# EAGLE schematic typewriter_shift (EAGLE 7.2.0)
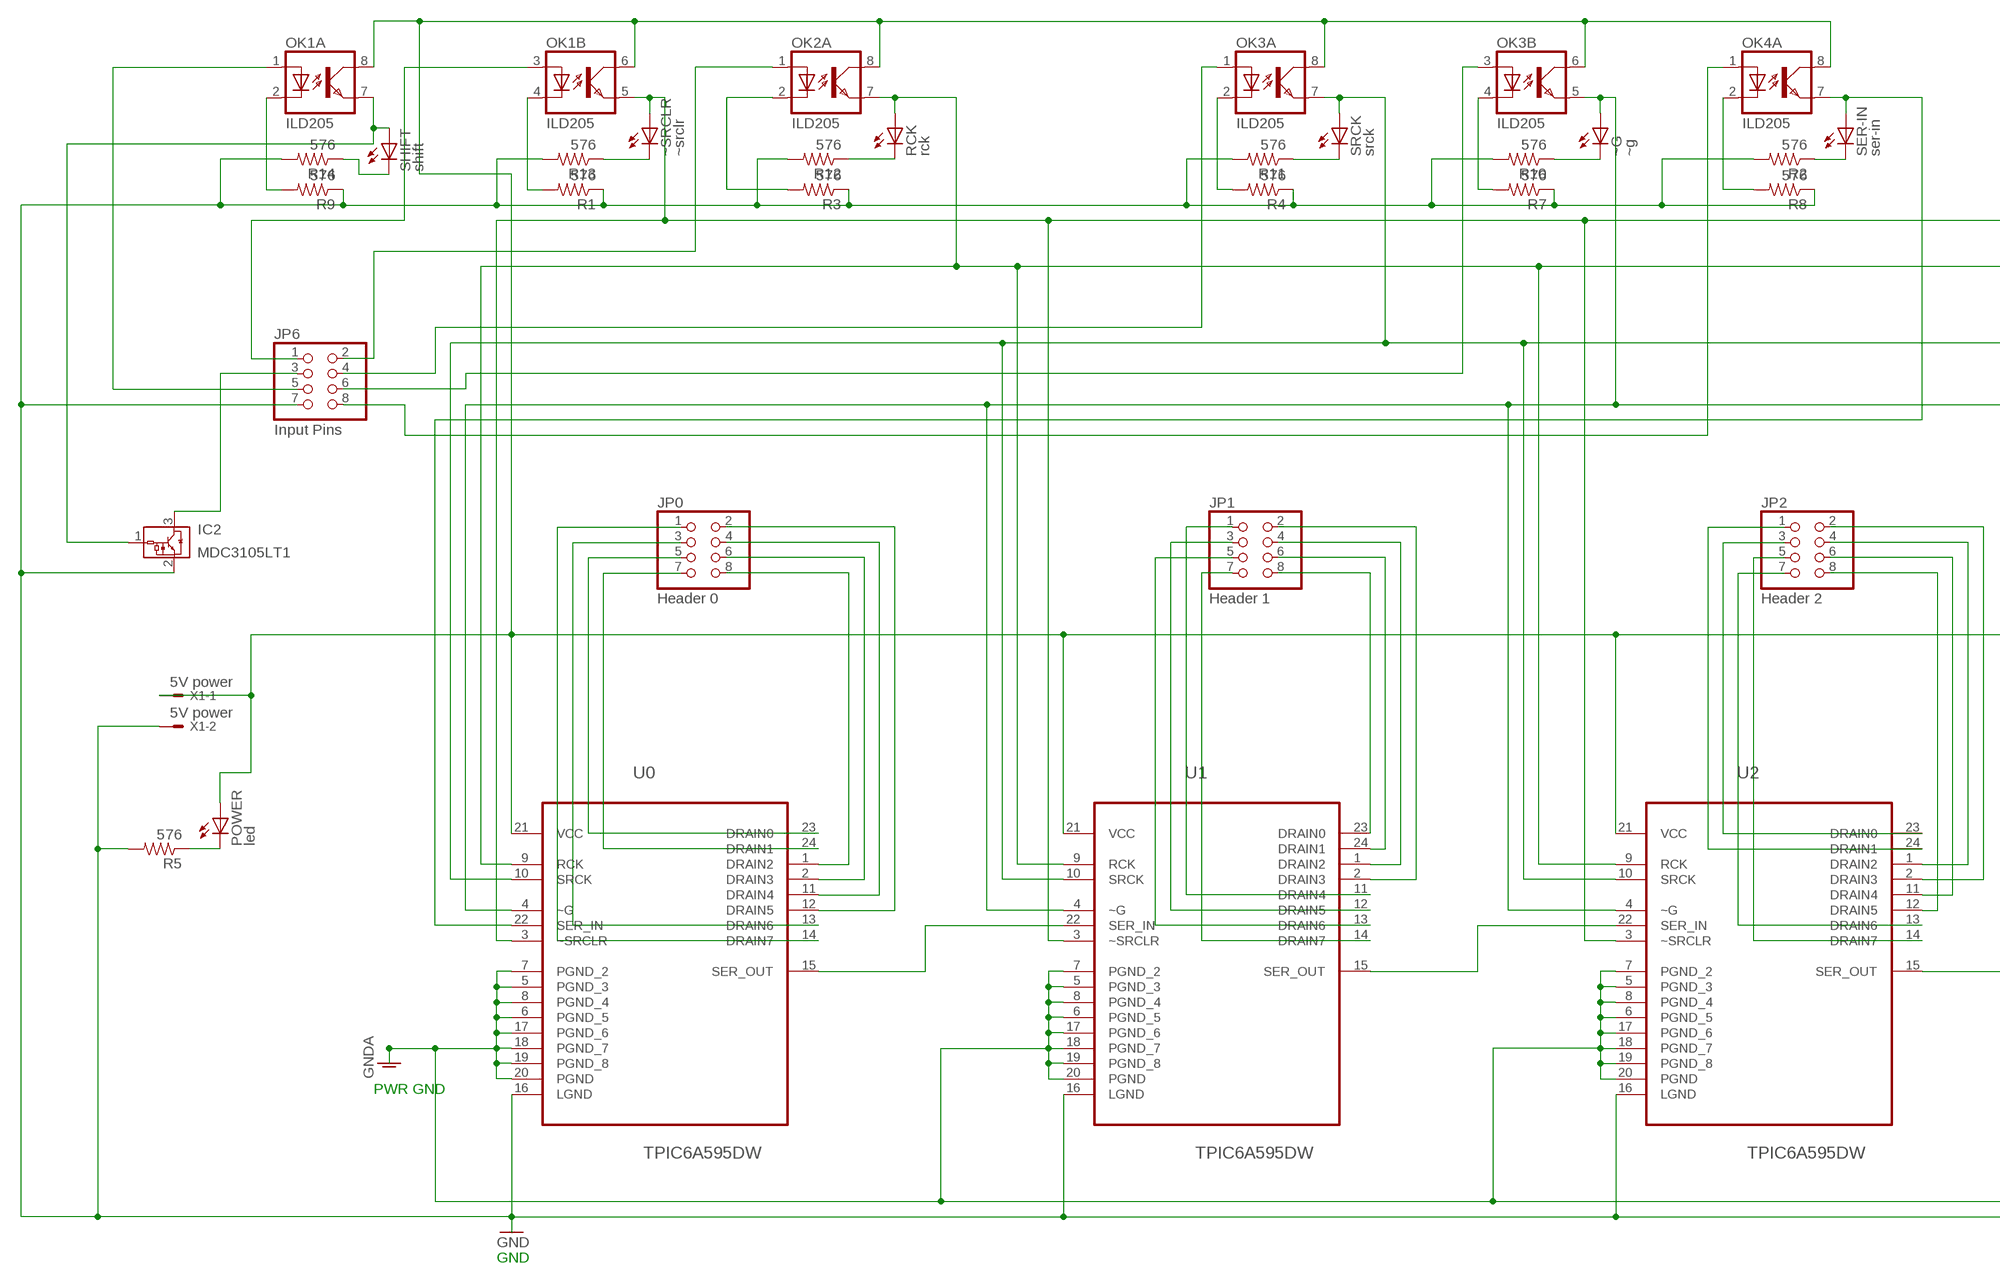
[diagram p0: schematic, sheet 1, part 1 of 2]
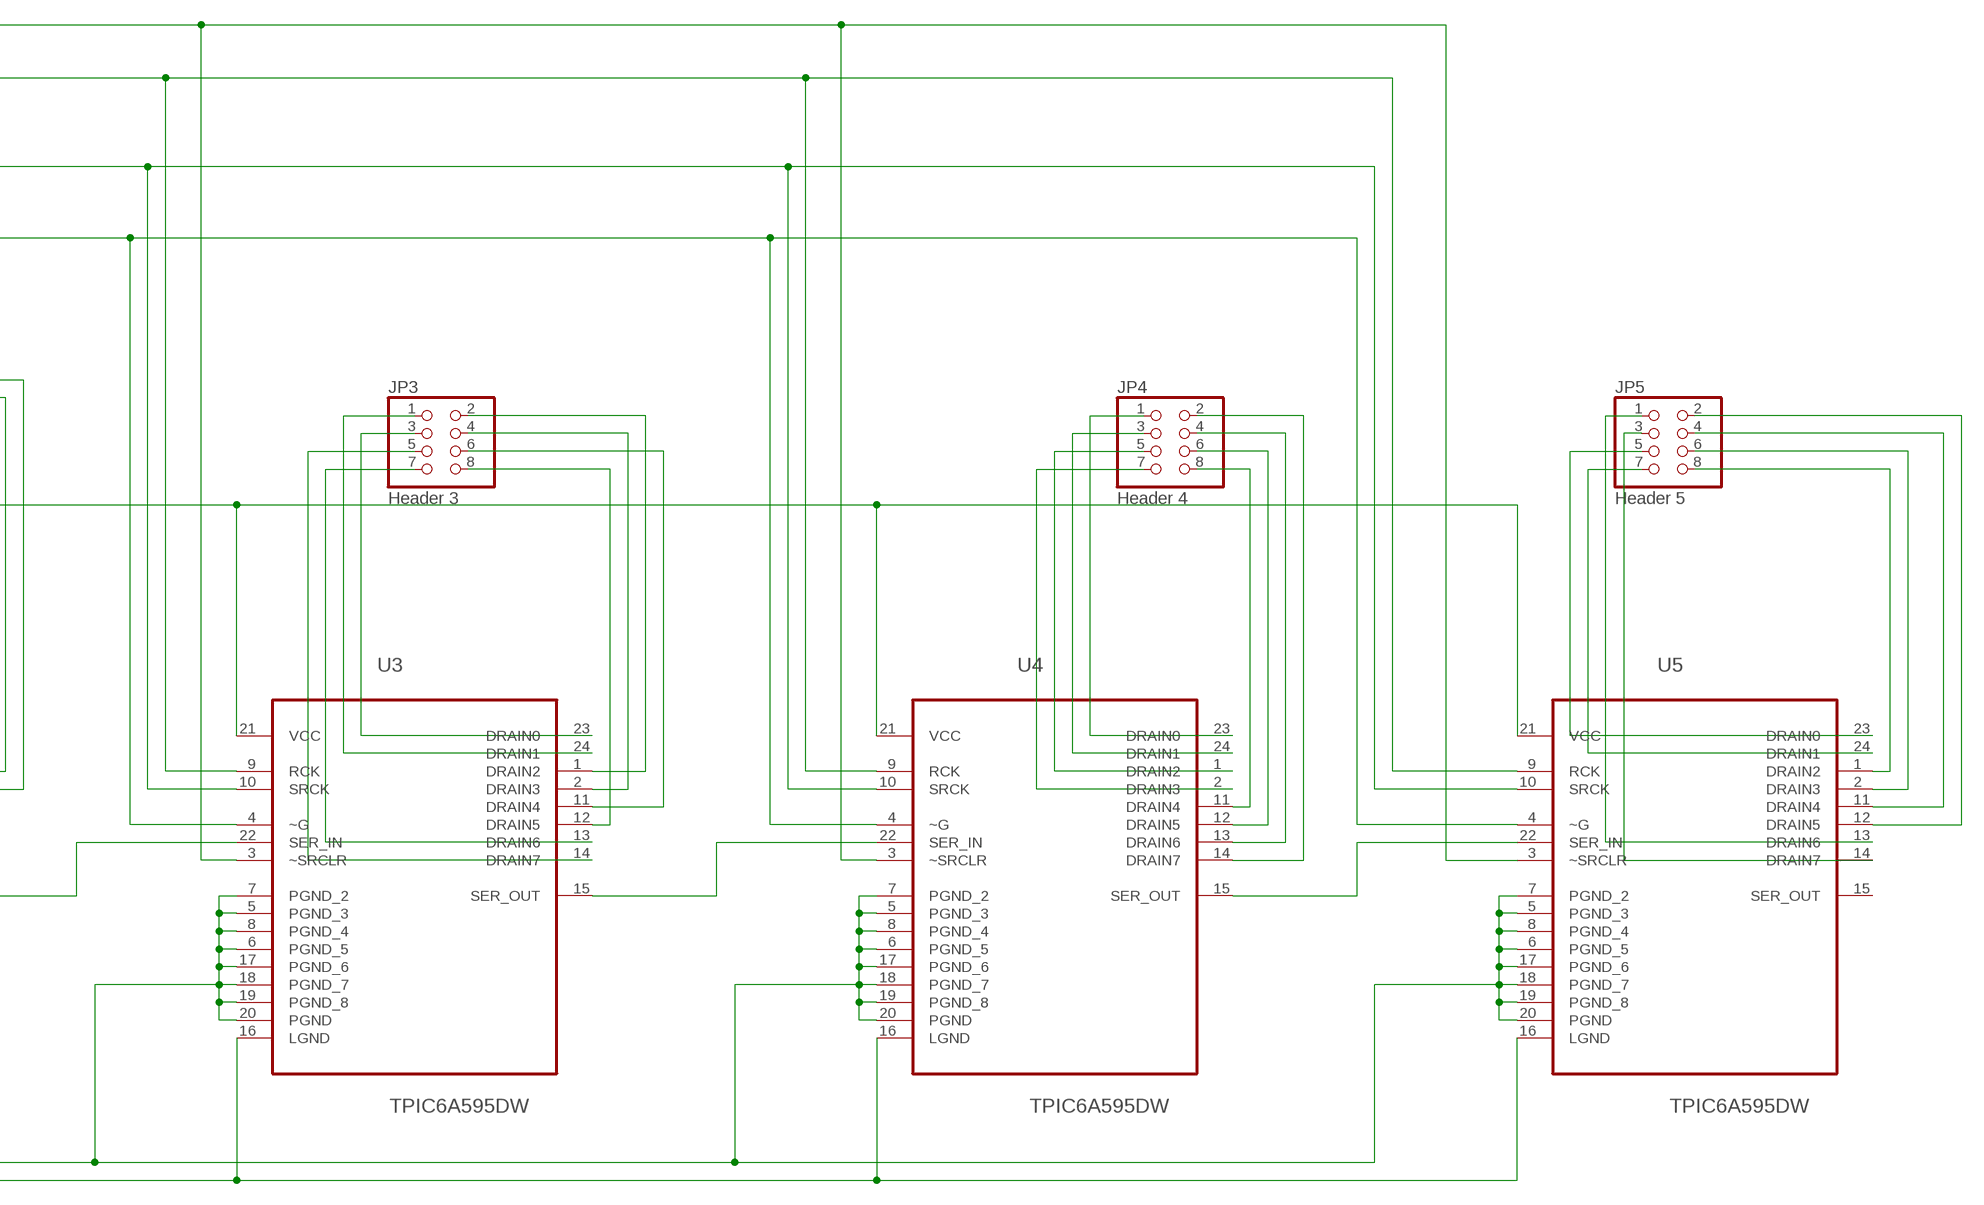
[diagram p1: schematic, sheet 1, part 2 of 2]

## Parts
IC2  MDC3105LT1  [SOT23]
JP0  Header 0  PINHD-2X4/90  [2X04/90]
JP1  Header 1  PINHD-2X4/90  [2X04/90]
JP2  Header 2  PINHD-2X4/90  [2X04/90]
JP3  Header 3  PINHD-2X4/90  [2X04/90]
JP4  Header 4  PINHD-2X4/90  [2X04/90]
JP5  Header 5  PINHD-2X4/90  [2X04/90]
JP6  Input Pins  PINHD-2X4/90  [2X04/90]
OK1  ILD205  [SOIC08]
OK2  ILD205  [SOIC08]
OK3  ILD205  [SOIC08]
OK4  ILD205  [SOIC08]
POWER  led  LEDSML1206  [SML1206]
R1  576  R-US_R2512  [R2512]
R2  576  R-US_R2512  [R2512]
R3  576  R-US_R2512  [R2512]
R4  576  R-US_R2512  [R2512]
R5  576  R-US_R2512  [R2512]
R7  576  R-US_R2512  [R2512]
R8  576  R-US_R2512  [R2512]
R9  576  R-US_R2512  [R2512]
R10  576  R-US_R2512  [R2512]
R11  576  R-US_R2512  [R2512]
R12  576  R-US_R2512  [R2512]
R13  576  R-US_R2512  [R2512]
R14  576  R-US_R2512  [R2512]
RCK  rck  LEDSML1206  [SML1206]
SER-IN  ser-in  LEDSML1206  [SML1206]
SHIFT  shift  LEDSML1206  [SML1206]
SRCK  srck  LEDSML1206  [SML1206]
U0  TPIC6A595DW  [SOIC127P1030X265-24N]
U1  TPIC6A595DW  [SOIC127P1030X265-24N]
U2  TPIC6A595DW  [SOIC127P1030X265-24N]
U3  TPIC6A595DW  [SOIC127P1030X265-24N]
U4  TPIC6A595DW  [SOIC127P1030X265-24N]
U5  TPIC6A595DW  [SOIC127P1030X265-24N]
X1  5V power  KK-156-2  [KK-156-2]
~G  ~g  LEDSML1206  [SML1206]
~SRCLR  ~srclr  LEDSML1206  [SML1206]

## Nets
GND: IC2.2(GND) JP6.7 R1.1 R2.2 R3.1 R4.1 R5.2 R7.1 R8.1 R9.1 R10.2 R11.2 R12.2 R13.2 R14.2 U0.16(LGND) U1.16(LGND) U2.16(LGND) U3.16(LGND) U4.16(LGND) U5.16(LGND) X1.2
GNDA: U0.5(PGND_3) U0.6(PGND_5) U0.7(PGND_2) U0.8(PGND_4) U0.17(PGND_6) U0.18(PGND_7) U0.19(PGND_8) U0.20(PGND) U1.5(PGND_3) U1.6(PGND_5) U1.7(PGND_2) U1.8(PGND_4) U1.17(PGND_6) U1.18(PGND_7) U1.19(PGND_8) U1.20(PGND) U2.5(PGND_3) U2.6(PGND_5) U2.7(PGND_2) U2.8(PGND_4) U2.17(PGND_6) U2.18(PGND_7) U2.19(PGND_8) U2.20(PGND) U3.5(PGND_3) U3.6(PGND_5) U3.7(PGND_2) U3.8(PGND_4) U3.17(PGND_6) U3.18(PGND_7) U3.19(PGND_8) U3.20(PGND) U4.5(PGND_3) U4.6(PGND_5) U4.7(PGND_2) U4.8(PGND_4) U4.17(PGND_6) U4.18(PGND_7) U4.19(PGND_8) U4.20(PGND) U5.5(PGND_3) U5.6(PGND_5) U5.7(PGND_2) U5.8(PGND_4) U5.17(PGND_6) U5.18(PGND_7) U5.19(PGND_8) U5.20(PGND)
N$1: U0.15(SER_OUT) U1.22(SER_IN)
N$2: U1.15(SER_OUT) U2.22(SER_IN)
N$3: U2.15(SER_OUT) U3.22(SER_IN)
N$4: U3.15(SER_OUT) U4.22(SER_IN)
N$5: U4.15(SER_OUT) U5.22(SER_IN)
N$6: R12.1 RCK.C
N$7: OK4.7(A:EMIT) SER-IN.A U0.22(SER_IN)
N$8: R13.1 ~SRCLR.C
N$9: JP0.7 U0.24(DRAIN1)
N$11: JP6.5 OK1.1(A:A)
N$12: JP0.5 U0.23(DRAIN0)
N$13: JP0.8 U0.1(DRAIN2)
N$14: JP0.6 U0.2(DRAIN3)
N$15: IC2.3(VOUT) JP6.3
N$16: IC2.1(VIN) OK1.7(A:EMIT) SHIFT.A
N$17: OK1.2(A:C) R9.2
N$18: JP0.4 U0.11(DRAIN4)
N$19: JP0.2 U0.12(DRAIN5)
N$20: JP6.1 OK1.3(B:A)
N$21: JP0.3 U0.13(DRAIN6)
N$22: JP0.1 U0.14(DRAIN7)
N$23: JP6.2 OK2.1(A:A)
N$24: JP1.4 U1.1(DRAIN2)
N$25: JP1.6 U1.24(DRAIN1)
N$26: JP1.8 U1.23(DRAIN0)
N$27: JP1.2 U1.2(DRAIN3)
N$28: JP1.1 U1.11(DRAIN4)
N$29: JP6.4 OK3.1(A:A)
N$30: JP6.8 OK4.1(A:A)
N$31: JP6.6 OK3.3(B:A)
N$32: OK3.4(B:C) R7.2
N$33: JP1.7 U1.14(DRAIN7)
N$34: JP1.3 U1.12(DRAIN5)
N$35: JP1.5 U1.13(DRAIN6)
N$36: JP3.3 U3.23(DRAIN0)
N$37: JP2.6 U2.11(DRAIN4)
N$38: JP2.4 U2.1(DRAIN2)
N$39: JP2.2 U2.2(DRAIN3)
N$40: JP2.5 U2.14(DRAIN7)
N$41: JP2.7 U2.13(DRAIN6)
N$42: JP2.3 U2.23(DRAIN0)
N$43: JP2.1 U2.24(DRAIN1)
N$44: JP2.8 U2.12(DRAIN5)
N$45: JP3.1 U3.24(DRAIN1)
N$46: JP3.2 U3.1(DRAIN2)
N$47: JP3.4 U3.2(DRAIN3)
N$48: JP3.6 U3.11(DRAIN4)
N$49: JP3.8 U3.12(DRAIN5)
N$50: JP3.7 U3.13(DRAIN6)
N$51: JP3.5 U3.14(DRAIN7)
N$52: JP4.1 U4.23(DRAIN0)
N$53: JP4.3 U4.24(DRAIN1)
N$54: JP4.5 U4.1(DRAIN2)
N$55: JP4.7 U4.2(DRAIN3)
N$56: JP4.8 U4.11(DRAIN4)
N$57: JP4.6 U4.12(DRAIN5)
N$58: JP4.4 U4.13(DRAIN6)
N$59: JP4.2 U4.14(DRAIN7)
N$60: JP5.5 U5.23(DRAIN0)
N$61: JP5.7 U5.24(DRAIN1)
N$62: JP5.8 U5.1(DRAIN2)
N$63: JP5.6 U5.2(DRAIN3)
N$64: JP5.4 U5.11(DRAIN4)
N$65: JP5.2 U5.12(DRAIN5)
N$66: JP5.1 U5.13(DRAIN6)
N$67: JP5.3 U5.14(DRAIN7)
N$68: OK3.5(B:EMIT) U0.4(~G) U1.4(~G) U2.4(~G) U3.4(~G) U4.4(~G) U5.4(~G) ~G.A
N$69: OK3.7(A:EMIT) SRCK.A U0.10(SRCK) U1.10(SRCK) U2.10(SRCK) U3.10(SRCK) U4.10(SRCK) U5.10(SRCK)
N$70: OK2.7(A:EMIT) RCK.A U0.9(RCK) U1.9(RCK) U2.9(RCK) U3.9(RCK) U4.9(RCK) U5.9(RCK)
N$71: OK1.5(B:EMIT) U0.3(~SRCLR) U1.3(~SRCLR) U2.3(~SRCLR) U3.3(~SRCLR) U4.3(~SRCLR) U5.3(~SRCLR) ~SRCLR.A
N$72: OK4.2(A:C) R8.2
N$73: R14.1 SHIFT.C
N$74: R11.1 SRCK.C
N$75: R10.1 ~G.C
N$76: OK3.2(A:C) R4.2
N$77: OK2.2(A:C) R3.2
N$78: OK1.4(B:C) R1.2
N$79: R2.1 SER-IN.C
N$80: POWER.C R5.1
VCC: OK1.6(B:COL) OK1.8(A:COL) OK2.8(A:COL) OK3.6(B:COL) OK3.8(A:COL) OK4.8(A:COL) POWER.A U0.21(VCC) U1.21(VCC) U2.21(VCC) U3.21(VCC) U4.21(VCC) U5.21(VCC) X1.1
Unconnected: OK2.3(B:A) OK2.4(B:C) OK2.5(B:EMIT) OK2.6(B:COL) OK4.3(B:A) OK4.4(B:C) OK4.5(B:EMIT) OK4.6(B:COL) U5.15(SER_OUT)

## Notes on the sheet
- PWR GND
- GND

## Library data of the parts
IC2 = on-semiconductor:MDC3105LT1: Integrated Relay, Inductive Load Driver Sopurce: U6 OnSemi Inductive Load Driver MDC3105-D.PDF; MF: ON SEMICONDUCTOR; MPN: MDC3105LT1; OC_FARNELL: 1126459; OC_NEWARK: 16F6132
JP0 JP1-JP6 = pinhead:PINHD-2X4: PIN HEADER
OK1-OK4 = optocoupler:ILD2*: Siemens ILD205/206/207/211/213/217 DUAL PHOTOTRANSISTOR SMALL OUTLINE SURFACE MOUNT OPTOCOUPLER Source: 153385-da-01-en-Optocoupler_ILD205-T.pdf; MF: VISHAY/TELEFUNKEN; MPN: ILD205T; OC_FARNELL: 1469512; OC_NEWARK: 20H8678
POWER RCK SER-IN SHIFT SRCK ~G ~SRCLR = led:LED: LED OSRAM: - CHIPLED LG R971, LG N971, LY N971, LG Q971, LY Q971, LO R971, LY R971 LH N974, LH R974 LS Q976, LO Q976, LY Q976 LO Q996 - Hyper CHIPLED LW Q18S LB Q993, LB Q99A, LB R99A - SideLED LS A670, LO A670, LY A670, LG A670, LP A670 LB A673, LV A673, LT A673, LW A673 LH A674 LY A675 LS A676, LA A676, LO A676, LY A676, LW A676 LS A679, LY A679, LG A679 - Hyper Micro SIDELED® LS Y876, LA Y876, LO Y876, LY Y876 LT Y87S - SmartLED LW L88C, LW L88S LB L89C, LB L89S, LG L890 LS L89K, LO L89K, LY L89K LS L896, LA L896, LO L896, LY L896 - TOPLED LS T670, LO T670, LY T670, LG T670, LP T670 LSG T670, LSP T670, LSY T670, LOP T670, LYG T670 LG T671, LOG T671, LSG T671 LB T673, LV T673, LT T673, LW T673 LH T674 LS T676, LA T676, LO T676, LY T676, LB T676, LH T676, LSB T676, LW T676 LB T67C, LV T67C, LT T67C, LS T67K, LO T67K, LY T67K, LW E67C LS E67B, LA E67B, LO E67B, LY E67B, LB E67C, LV E67C, LT E67C LW T67C LS T679, LY T679, LG T679 LS T770, LO T770, LY T770, LG T770, LP T770 LB T773, LV T773, LT T773, LW T773 LH T774 LS E675, LA E675, LY E675, LS T675 LS T776, LA T776, LO T776, LY T776, LB T776 LHGB T686 LT T68C, LB T68C - Hyper Mini TOPLED® LB M676 - Mini TOPLED Santana® LG M470 LS M47K, LO M47K, LY M47K Source: http://www.osram.convergy.de LUXEON: - LUMILED® LXK2-PW12-R00, LXK2-PW12-S00, LXK2-PW14-U00, LXK2-PW14-V00 LXK2-PM12-R00, LXK2-PM12-S00, LXK2-PM14-U00 LXK2-PE12-Q00, LXK2-PE12-R00, LXK2-PE12-S00, LXK2-PE14-T00, LXK2-PE14-U00 LXK2-PB12-K00, LXK2-PB12-L00, LXK2-PB12-M00, LXK2-PB14-N00, LXK2-PB14-P00, LXK2-PB14-Q00 LXK2-PR12-L00, LXK2-PR12-M00, LXK2-PR14-Q00, LXK2-PR14-R00 LXK2-PD12-Q00, LXK2-PD12-R00, LXK2-PD12-S00 LXK2-PH12-R00, LXK2-PH12-S00 LXK2-PL12-P00, LXK2-PL12-Q00, LXK2-PL12-R00 Source: www.luxeon.com KINGBRIGHT: KA-3528ASYC Source: www.kingbright.com
R1-R5 R7-R14 = resistor:R-US_: RESISTOR, American symbol
U0 U1-U5 = Texas Instruments_By_element14_Batch_1:TPIC6A595DW: POWER LOGIC 8-BIT SHIFT REGISTER; MPN: TPIC6A595DW; OC_FARNELL: -; OC_NEWARK: 83F9188; PACKAGE: SOIC-24; SUPPLIER: Texas Instruments
X1 = con-molex:KK-156-2: KK 156 HEADER Source: http://www.molex.com/pdm_docs/sd/026604100_sd.pdf; OC_FARNELL: unknown; OC_NEWARK: unknown